# EAGLE schematic zero-hm-10-breakout (EAGLE 6.5.0)
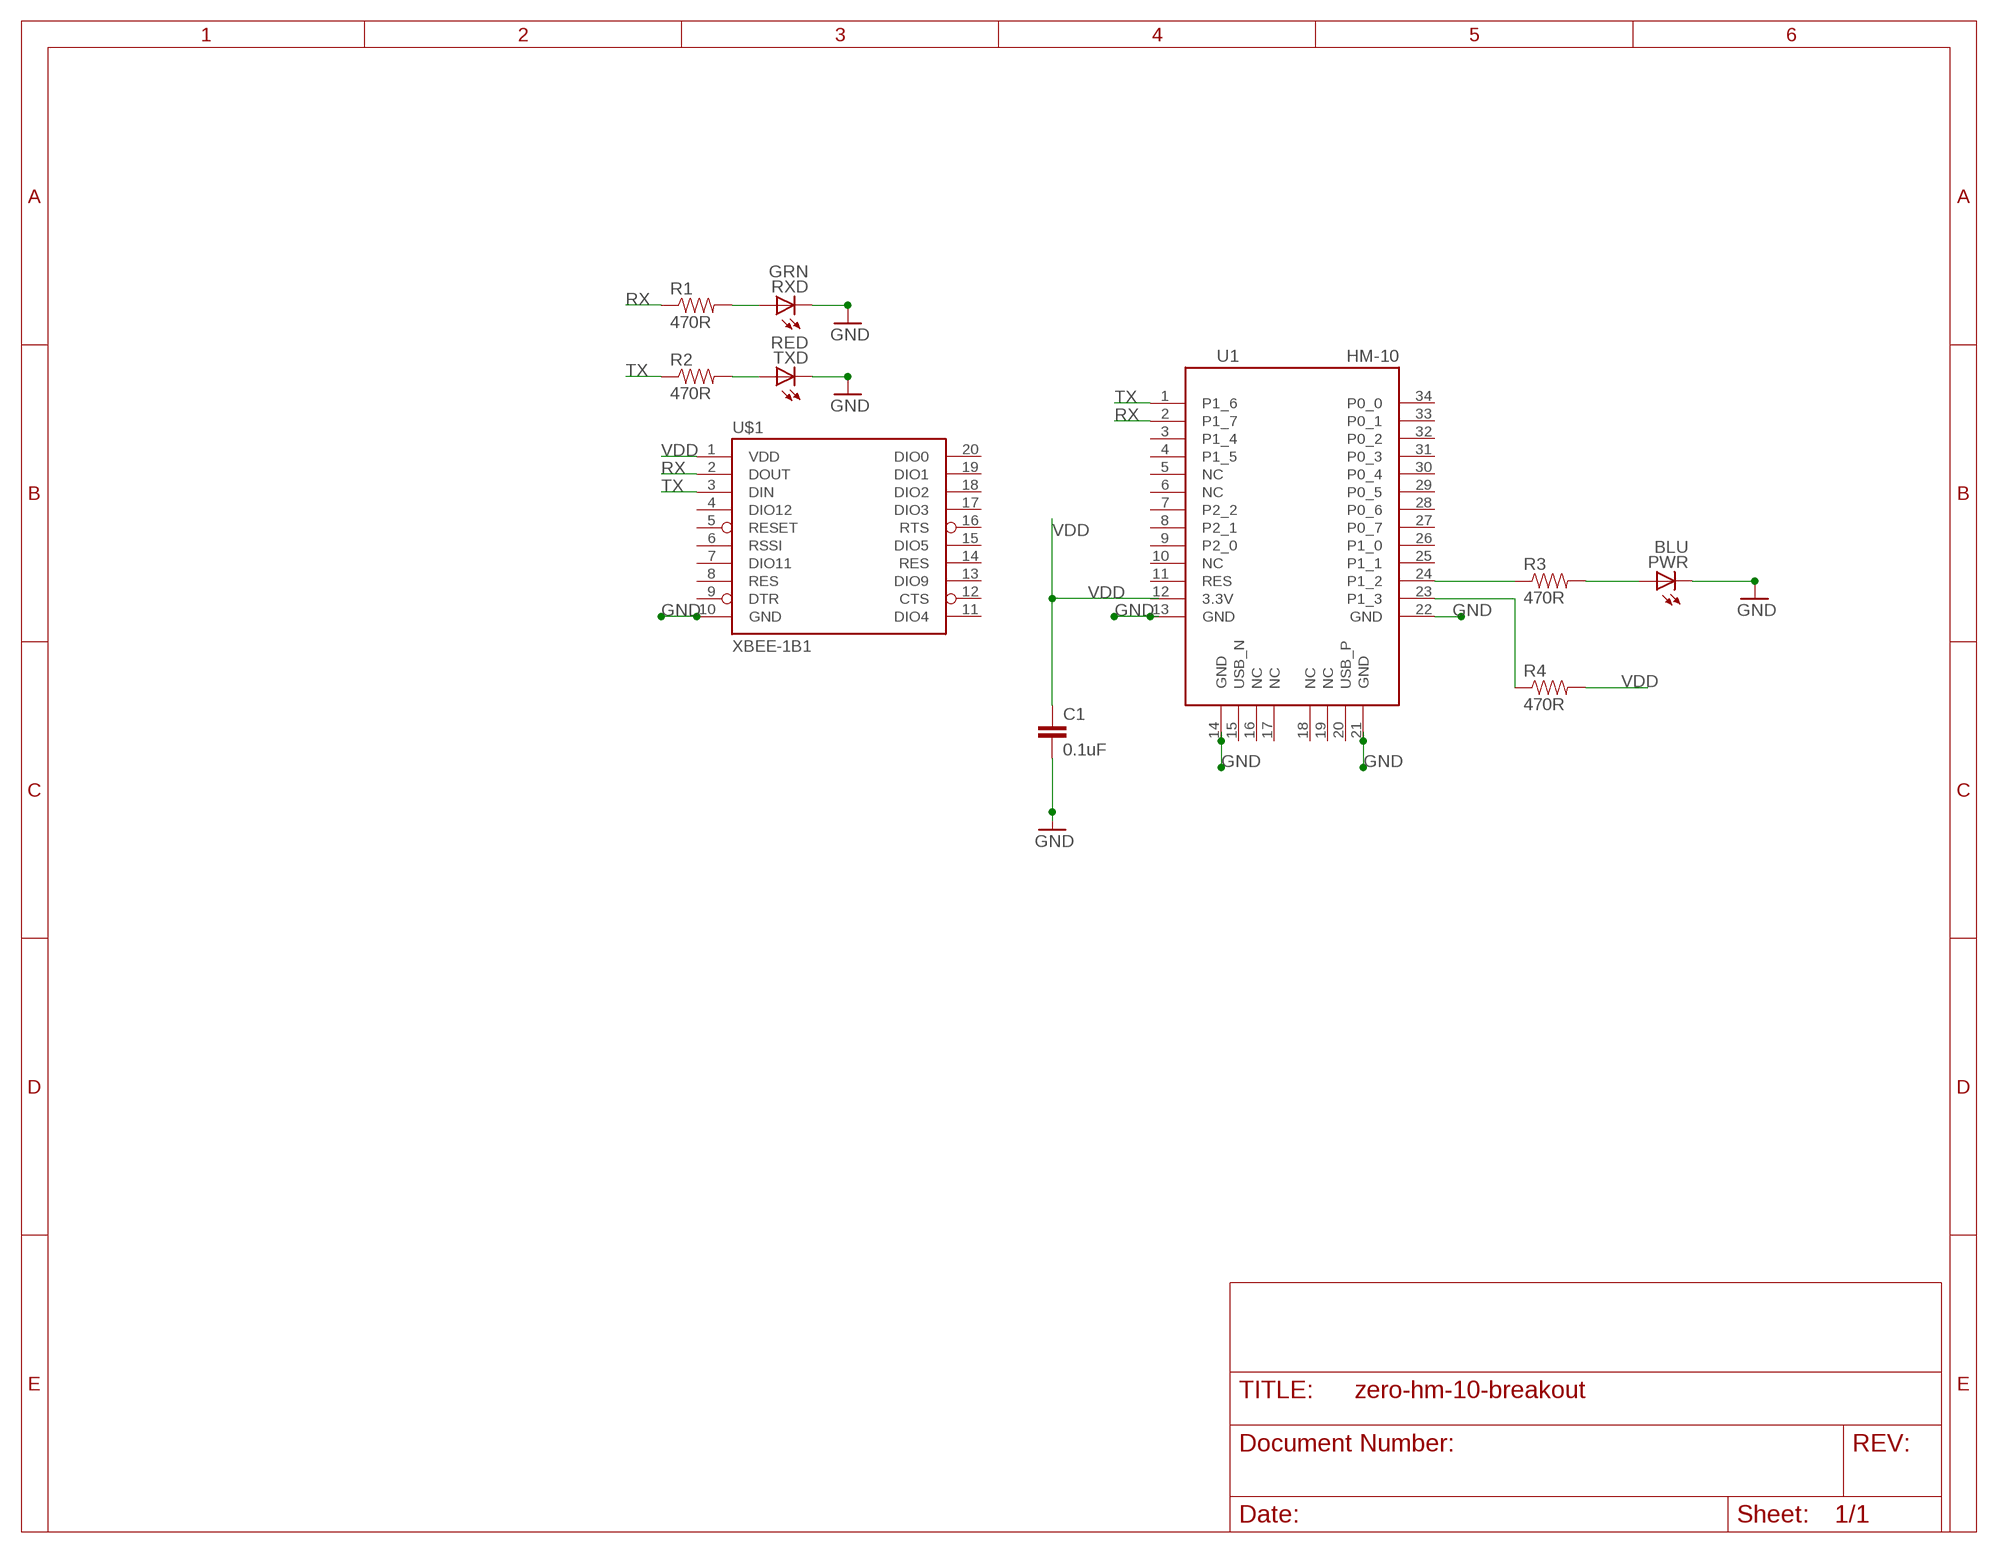
[diagram p0: schematic, sheet 1]

## Parts
C1  0.1uF  0.1UF-25V(+80/-20%)(0603)  [0603-CAP]
PWR  BLU  LEDCHIPLED_0805  [CHIPLED_0805]
R1  470R  0.3OHM-1/8W-1%(0805)  [0805]
R2  470R  0.3OHM-1/8W-1%(0805)  [0805]
R3  470R  0.3OHM-1/8W-1%(0805)  [0805]
R4  470R  0.3OHM-1/8W-1%(0805)  [0805]
RXD  GRN  LEDCHIPLED_0805  [CHIPLED_0805]
TXD  RED  LEDCHIPLED_0805  [CHIPLED_0805]
U1  HM-10  [HM-10]
U$1  XBEE-1B1  [XBEE-1]

## Nets
GND: C1.2 PWR.C RXD.C TXD.C U1.13(GND) U1.14(GND) U1.21(GND) U1.22(GND) U$1.10(GND)
N$1: R2.2 TXD.A
N$2: R1.2 RXD.A
N$3: PWR.A R3.2
N$4: R3.1 U1.24(P1_2)
N$5: R4.1 U1.23(P1_3)
RX: R1.1 U1.2(P1_7) U$1.2(DOUT)
TX: R2.1 U1.1(P1_6) U$1.3(DIN)
VDD: C1.1 R4.2 U1.12(3.3V) U$1.1(VDD)
Unconnected: U1.3(P1_4) U1.4(P1_5) U1.5(NC) U1.6(NC) U1.7(P2_2) U1.8(P2_1) U1.9(P2_0) U1.10(NC) U1.11(RES) U1.15(USB_N) U1.16(NC) U1.17(NC) U1.18(NC) U1.19(NC) U1.20(USB_P) U1.25(P1_1) U1.26(P1_0) U1.27(P0_7) U1.28(P0_6) U1.29(P0_5) U1.30(P0_4) U1.31(P0_3) U1.32(P0_2) U1.33(P0_1) U1.34(P0_0) U$1.4(DIO12) U$1.5(RESET) U$1.6(RSSI) U$1.7(DIO11) U$1.8(RES) U$1.9(DTR) U$1.11(DIO4) U$1.12(CTS) U$1.13(DIO9) U$1.14(RES) U$1.15(DIO5) U$1.16(RTS) U$1.17(DIO3) U$1.18(DIO2) U$1.19(DIO1) U$1.20(DIO0)

## Library data of the parts
C1 = SparkFun-Capacitors:0.1UF-25V(+80/-20%)(0603): CAP-00810 Ceramic Standard decoupling cap; PROD_ID: CAP-00810
PWR RXD TXD = adafruit:LED: LED OSRAM: - CHIPLED LG R971, LG N971, LY N971, LG Q971, LY Q971, LO R971, LY R971 LH N974, LH R974 LS Q976, LO Q976, LY Q976 LO Q996 - Hyper CHIPLED LW Q18S LB Q993, LB Q99A, LB R99A - SideLED LS A670, LO A670, LY A670, LG A670, LP A670 LB A673, LV A673, LT A673, LW A673 LH A674 LY A675 LS A676, LA A676, LO A676, LY A676, LW A676 LS A679, LY A679, LG A679 - Hyper Micro SIDELED® LS Y876, LA Y876, LO Y876, LY Y876 LT Y87S - SmartLED LW L88C, LW L88S LB L89C, LB L89S, LG L890 LS L89K, LO L89K, LY L89K LS L896, LA L896, LO L896, LY L896 - TOPLED LS T670, LO T670, LY T670, LG T670, LP T670 LSG T670, LSP T670, LSY T670, LOP T670, LYG T670 LG T671, LOG T671, LSG T671 LB T673, LV T673, LT T673, LW T673 LH T674 LS T676, LA T676, LO T676, LY T676, LB T676, LH T676, LSB T676, LW T676 LB T67C, LV T67C, LT T67C, LS T67K, LO T67K, LY T67K, LW E67C LS E67B, LA E67B, LO E67B, LY E67B, LB E67C, LV E67C, LT E67C LW T67C LS T679, LY T679, LG T679 LS T770, LO T770, LY T770, LG T770, LP T770 LB T773, LV T773, LT T773, LW T773 LH T774 LS E675, LA E675, LY E675, LS T675 LS T776, LA T776, LO T776, LY T776, LB T776 LHGB T686 LT T68C, LB T68C - Hyper Mini TOPLED® LB M676 - Mini TOPLED Santana® LG M470 LS M47K, LO M47K, LY M47K Source: http://www.osram.convergy.de/
R1-R4 = SparkFun-Resistors:0.3OHM-1/8W-1%(0805); PROD_ID: RES-11622; VALUE: 0.3
U1 = HM-10_BLE:HM-10
U$1 = SparkFun-RF:XBEE-1: Xbee module footprints SMT header is CONN-09042.